# EAGLE design CPbyTimmer555 (EAGLE 9.3.2)
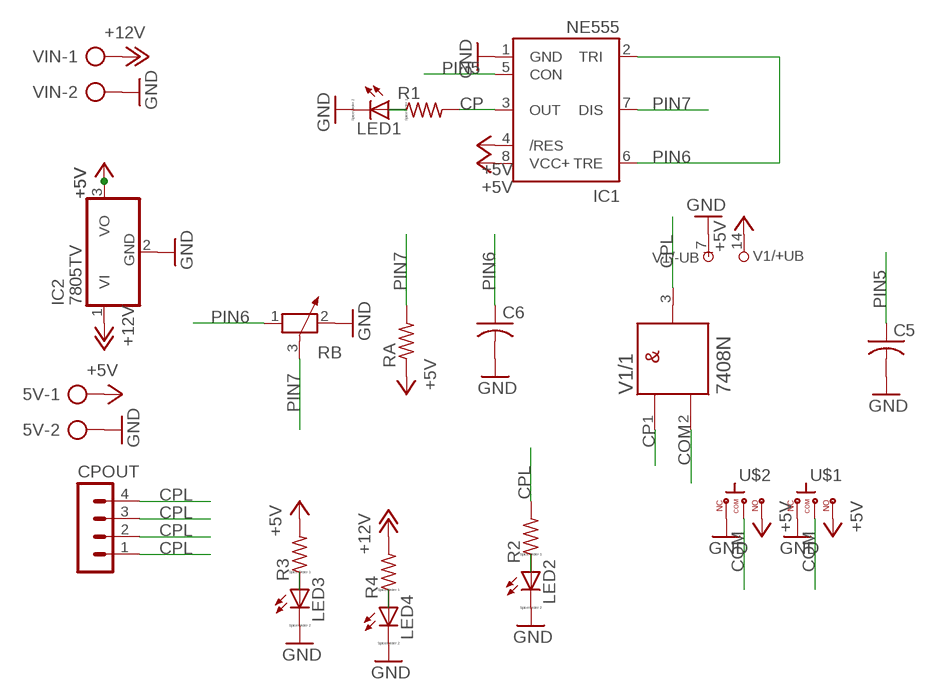
[diagram p0: schematic, sheet 1]

## Parts
5V  AK500/2-H  [AK500/2-H]
C5  C-US025-025X050  [C025-025X050]
C6  C-US025-025X050  [C025-025X050]
CPOUT  MA04-1  [MA04-1]
IC1  NE555  [DIL-08]
IC2  7805TV  [TO220V]
LED1  LED_ELD260  [LED_LD260]
LED2  LED_ELD260  [LED_LD260]
LED3  LED_ELD260  [LED_LD260]
LED4  LED_ELD260  [LED_LD260]
R1  R-US_0204/5  [0204/5]
R2  R-US_0204/5  [0204/5]
R3  R-US_0204/5  [0204/5]
R4  R-US_0204/5  [0204/5]
RA  R-US_0204/5  [0204/5]
RB  POTENTIOMETER_PT-10  [PT-10]
U$1  -SWITCH  [CON3]
U$2  -SWITCH  [CON3]
V1  7408N  [DIL14]
VIN  AK500/2-H  [AK500/2-H]

## Nets
+5V: 5V.1 IC1.4(/RES) IC1.8(VCC+) IC2.3(VO) R3.2 RA.1 U$1.P$3 U$2.P$3 V1.14(/+UB:+UB)
+12V: IC2.1(VI) R4.2 VIN.1
COM: U$1.P$2 U$2.P$2 V1.2(/1:B)
CP: IC1.3(OUT) R1.2 V1.1(/1:A)
CPL: CPOUT.1 CPOUT.2 CPOUT.3 CPOUT.4 R2.2 V1.3(/1:Y)
GND: 5V.2 C5.2 C6.2 IC1.1(GND) IC2.2(GND) LED1.K(C) LED2.K(C) LED3.K(C) LED4.K(C) RB.2 U$1.P$1 U$2.P$1 V1.7(/-UB:-UB) VIN.2
N$3: LED1.A R1.1
N$4: LED2.A R2.1
N$5: LED3.A R3.1
N$6: LED4.A R4.1
PIN5: C5.1 IC1.5(CON)
PIN6: C6.1 IC1.2(TRI) IC1.6(TRE) RB.1
PIN7: IC1.7(DIS) RA.2 RB.3
Unconnected: V1.4(/2:A) V1.5(/2:B) V1.6(/2:Y) V1.8(/3:Y) V1.9(/3:A) V1.10(/3:B) V1.11(/4:Y) V1.12(/4:A) V1.13(/4:B)

## Library data of the parts
5V VIN = con-ptr500:AK500/2-H: CONNECTOR Aug. 2004 / PTR Meßtechnik: Die Bezeichnung der Serie AK505 wurde geändert. Es handelt sich hierbei um AK500 in horizontaler Ausführung.; OC_FARNELL: unknown; OC_NEWARK: unknown
C5 C6 = rcl:C-US: CAPACITOR, American symbol; SPICEPREFIX: C
CPOUT = con-lstb:MA04-1: PIN HEADER; OC_FARNELL: unknown; OC_NEWARK: unknown
IC1 = st-microelectronics:NE555: General purpose bipolar Timer; MF: Arrow Electronics; MPN: NE555N; OC_FARNELL: 1467742; OC_NEWARK: 89K1486
IC2 = linear:78*: Positive VOLTAGE REGULATOR Source: http://cache.national.com/ds/LM/LM78L05.pdf http://www.fairchildsemi.com/ds/LM/LM7805.pdf
LED1-LED4 = eagle-ltspice:LED_E: LED Source: http://www.osram.convergy.de Source: www.luxeon.com Source: www.kingbright.com; SPICEMODEL: NONE; SPICEPREFIX: D; SPICETYPE: diode
R1-R4 RA = rcl:R-US_: RESISTOR, American symbol; SPICEPREFIX: R
RB = rcl:POTENTIOMETER_: Potentiometer; SPICEMODEL: POT; SPICEPREFIX: X
U$1 U$2 = tango:-SWITCH
V1 = 74ttl-din:74*08: Quad 2-input AND gate

## Net classes
0 default: clearance 0.205 mm

## Board
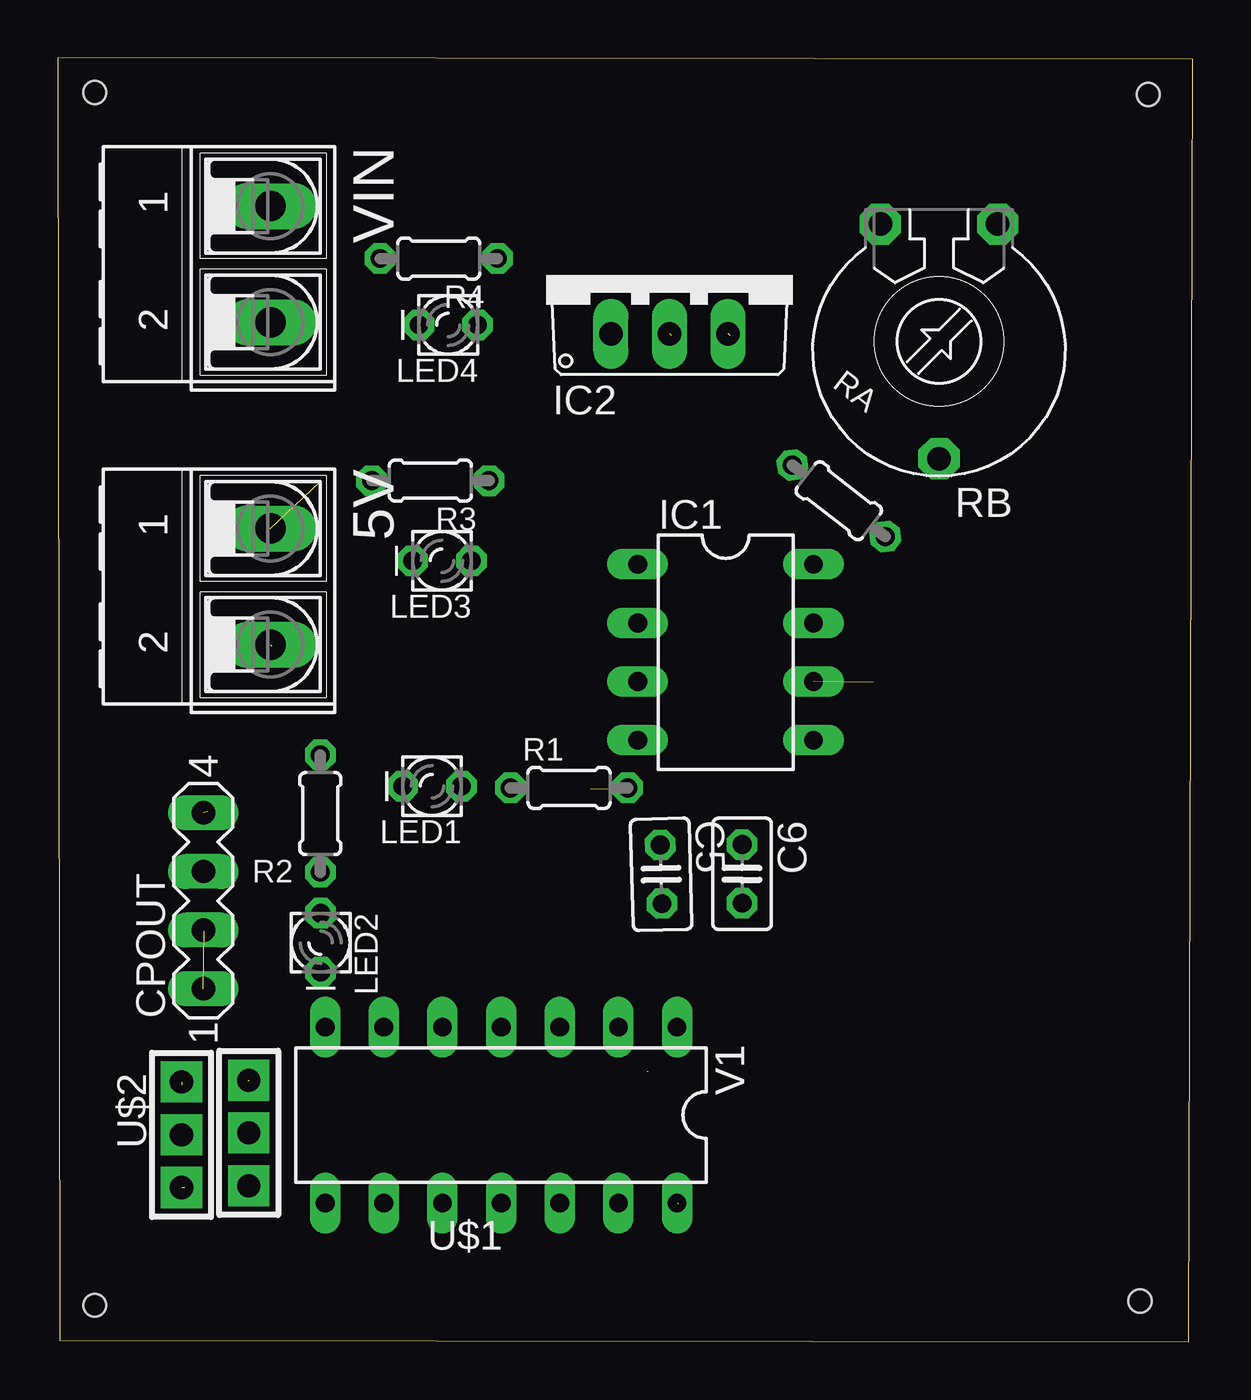
[diagram p1: board, top side]
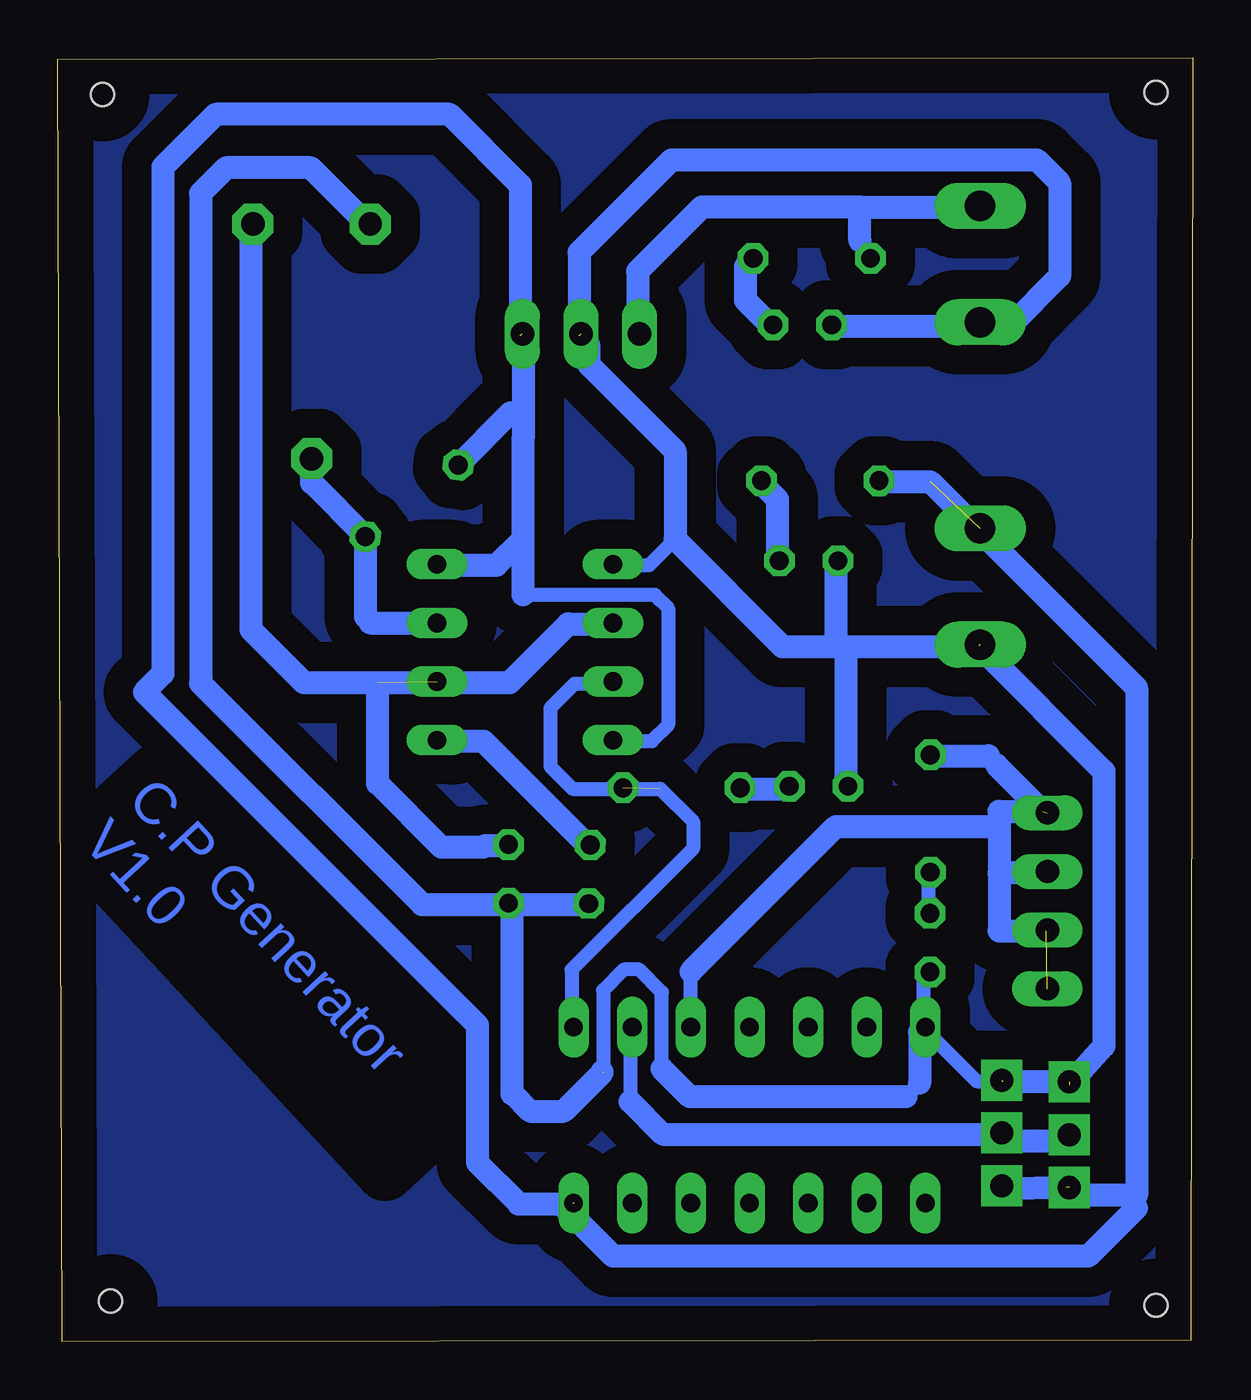
[diagram p2: board, bottom side, seen from below]

Size 49.16 x 55.63 mm. Coordinates in mm from the lower left corner, seen from the top.
Outline: 0.09,0.07 48.97,0 49.16,55.56 0,55.63 0.09,0.07
Copper layers (1*16): Top 0.035mm / dielectric 1.5mm / Bottom 0.035mm
Design rules "default *": minimum track width 16mil, minimum drill 0.35mm, track to track 16mil, track to pad 16mil, pad to pad 16mil, via to via 16mil, smd to smd 16mil, copper to edge 60mil, drill to drill 16mil, minimum pad ring 10mil, minimum via ring 8mil, stop-mask expansion 4mil, vias tented up to drill 0mil, thermal gap 10mil
Holes 1 mm at 1.6,54.12 47.23,54.03 46.87,1.76 1.6,1.58

### Footprints (pad centres in the part's own frame; a part is rotated, then mirrored left to right if it is on the bottom)
AK500/2-H = drill 1.321 long: 1 -2.515,0; 2 2.515,0
C025-025X050 = drill 0.813 octagon: 1 -1.27,0; 2 1.27,0
MA04-1 = drill 1.016 long: 1 -3.81,0; 2 -1.27,0; 3 1.27,0; 4 3.81,0
DIL-08 = drill 0.813 long: 1 -3.81,-3.81; 2 -1.27,-3.81; 3 1.27,-3.81; 4 3.81,-3.81; 5 3.81,3.81; 6 1.27,3.81; 7 -1.27,3.81; 8 -3.81,3.81
TO220V = drill 1.016 long: 1 -2.54,-2.54; 2 0,-2.54; 3 2.54,-2.54
LED_LD260 = drill 0.813 octagon: A -1.27,0; K 1.27,0
0204/5 = drill 0.813 octagon: 1 -2.54,0; 2 2.54,0
PT-10 = drill 1.016 pad 1.778 octagon: 1 -2.54,-5.08; 2 2.54,-5.08; 3 0,5.08
CON3 = drill 1 pad 1.778 square: P$1 -2.794,0.254; P$2 -0.508,0.254; P$3 1.778,0.254
DIL14 = drill 0.813 long: 1 -7.62,-3.81; 2 -5.08,-3.81; 3 -2.54,-3.81; 4 0,-3.81; 5 2.54,-3.81; 6 5.08,-3.81; 7 7.62,-3.81; 8 7.62,3.81; 9 5.08,3.81; 10 2.54,3.81; 11 0,3.81; 12 -2.54,3.81; 13 -5.08,3.81; 14 -7.62,3.81

### Placement (x,y rotation side)
5V  9.21,32.71 270 top
C5  26.13,20.25 271.6 top
C6  29.64,20.27 270 top
CPOUT  6.3,19.11 90 top
IC1  28.92,29.87 270 top
IC2  26.49,46.21 0 top
LED1  16.21,24.07 180 top
LED2  11.39,17.29 270 top
LED3  16.64,33.83 180 top
LED4  16.91,44.05 180 top
R1  22.14,24 0 top
R2  11.37,22.88 90 top
R3  16.14,37.31 180 top
R4  16.5,46.93 180 top
RA  33.82,36.43 322.4 top
RB  38.16,43.34 180 top
U$1  8.02,8.54 270 top
U$2  5.11,8.46 270 top
V1  19.2,9.82 180 top
VIN  9.21,46.68 270 top

### Tracks (layer width: path | path; a pad name or v marks a point on that pad's centre or on a via)
+5V  (4 unrouted)
  Bottom 0.406: 29.55,40.24 29,40.24
  Bottom 0.61: 29,32.36 23.3,32.36 22.73,31.78 22.73,26.72 23.43,26.02 25.07,26.02 IC1.4 | 26.86,5.97 27.27,5.97 27.27,5.87 | 8.28,6.64 8.27,6.64 U$1.P$3 | 2.44,6.36 2.44,5.8 | 5.49,6.68 5.16,6.36 | 29.12,43.58 29,43.51 | 29,34.78 29,35
  Bottom 1: R3.2 13.55,37.26 11.38,37.26 2.44,28.33 2.44,6.36 5.16,6.36 | 8.28,6.64 5.49,6.68 | 2.44,5.8 4.54,3.71 25.11,3.71 27.27,5.87 | 26.86,5.97 29.2,5.97 30.98,7.76 30.98,13.72 45.4,28.14 44.6,28.95 44.6,50.89 42.32,53.17 32.19,53.17 29.12,50.11 29.12,43.58 | IC1.8 32.69,33.64 30.15,33.64 29,34.78 | 29,32.36 29,35 29,39.12 29,40.24 29,43.51 | RA.1 29.55,40.24
+12V
  Bottom 0.61: 14.42,47.69 13.96,47.23 R4.2
  Bottom 1: 14.42,49.16 9.26,49.16 VIN.1 | 14.42,49.16 21.26,49.16 24.04,46.38 24.04,43.75 IC2.1 | 14.42,47.69 14.42,49.16
COM
  Bottom 0.61: U$1.P$2 8.32,9.05 8.37,9 8.08,8.71 | 5.66,8.71 5.4,8.97 U$2.P$2 | V1.2 24.37,13.55 24.37,10.41
  Bottom 1: 24.37,10.41 22.96,9 8.37,9 | 8.08,8.71 5.66,8.71
CP  (1 unrouted)
  Bottom 0.61: IC1.3 25.16,28.6 25.26,28.5 26.78,28.5 27.83,27.45 27.83,24.92 26.86,23.95 23.07,23.95 21.65,22.53 21.65,21.38 26.91,16.12 26.91,13.72 V1.1
CPL  (2 unrouted)
  Bottom 0.61: 8.51,24.99 8.51,25.03 8.86,25.38 | 8.37,17.79 8.39,17.82 | 8.35,20.33 8.39,20.3 | V1.3 21.74,13.67 21.74,16.04
  Bottom 1: 8.51,24.99 6.49,22.97 8.39,22.97 8.39,22.32 | R2.2 11.33,25.38 8.86,25.38 | 8.39,22.32 8.39,20.3 8.39,17.82 | 8.37,17.79 6.35,17.79 CPOUT.2 | 8.35,20.33 6.35,20.33 CPOUT.3 | 21.74,16.04 15.46,22.32 8.39,22.32
GND  (5 unrouted)
  Bottom 0.61: 9.34,30.12 9.28,30.14 | C5.2 26.21,18.94 | C6.2 29.71,18.94 29.97,18.94 29.48,18.44 | 5.53,11.29 5.36,11.12 | V1.7 11.67,13.72 11.67,15.95 11.42,15.98 LED2.K | 8.23,11.29 9.37,11.29 11.58,13.5 V1.7 | 11.83,13.42 11.62,13.63 V1.7 | 11.83,11.2 12.42,10.62 | 23,11.83 23,15.14 23.98,16.13 24.64,16.13 25.54,15.23 25.54,11.7 | 29.43,10.74 29.48,10.74 | 15.55,30.12 15.46,30.21 15.02,29.78 | VIN.2 9.26,44.17 9.42,44.01 7.92,44.01 | IC1.1 25.07,33.64 23.55,33.64 22.42,34.77
  Bottom 1: 29.71,18.94 26.21,18.94 | 29.97,18.94 33.38,18.94 42.96,28.52 42.96,49.76 41.86,50.86 38.19,50.86 35.75,48.42 RB.2 | 9.34,30.12 15.55,30.12 17.77,30.12 22.42,34.77 22.42,38.59 26.17,42.34 26.17,43.21 26.58,43.58 26.58,47.2 22.58,51.21 6.77,51.21 5.77,50.21 5.77,46.16 7.92,44.01 | 9.28,30.14 3.86,24.71 3.86,12.8 5.36,11.12 | 8.23,11.29 5.53,11.29 | 11.83,13.42 11.83,11.2 | 23,11.83 21.78,10.62 12.42,10.62 | 29.43,10.74 28.69,9.99 27.25,9.99 25.58,11.66 25.58,11.7 | 29.48,10.74 29.48,18.44 | LED3.K 15.46,33.75 15.46,30.21 | LED4.K 15.6,44.01 9.42,44.01 | 15.02,29.78 15.02,24.15 LED1.K
N$1
  pour Bottom (isolate 1.27): 49.16,55.56 0,55.63 0.09,0.07 48.97,0
N$3
  Bottom 0.61: 17.64,23.95 17.52,24.07 LED1.A
  Bottom 1: R1.1 19.56,23.95 17.64,23.95
N$4
  Bottom 0.61: R2.1 11.46,20.26 11.46,18.53 11.43,18.56 LED2.A
N$5
  Bottom 1: R3.1 18.68,37.18 18,36.5 18,33.92 LED3.A
N$6
  Bottom 1: LED4.A 18.31,44.05 19.38,45.12 19.38,46.59 R4.1
PIN5
  Bottom 0.61: C5.1 26.23,21.52 | 32.69,26.02 IC1.5
  Bottom 1: 26.23,21.52 30.72,26.02 32.69,26.02
PIN6  (1 unrouted)
  Bottom 0.61: 30.66,21.5 30.75,21.42 | 36.54,28.58 36.56,28.56
  Bottom 1: RB.1 40.79,48.33 40.79,30.85 38.5,28.56 36.56,28.56 35.3,28.56 | IC1.2 25.16,31.1 27.05,31.1 29.59,28.56 35.3,28.56 | 30.66,21.5 29.68,21.5 C6.1 | 30.75,21.42 32.54,21.42 35.3,24.18 35.3,28.56
PIN7
  Bottom 0.406: 35.84,31.4 35.86,31.37 35.63,31.14
  Bottom 1: 32.78,31.1 IC1.7 35.63,31.14 | RB.3 38.16,38.13 38.16,37.21 RA.2 35.84,31.4

### Text on the board
Bottom: C.P Generator / V1.0